# Altium schematic sheet SYSTEM_Control.SchDoc
size A4
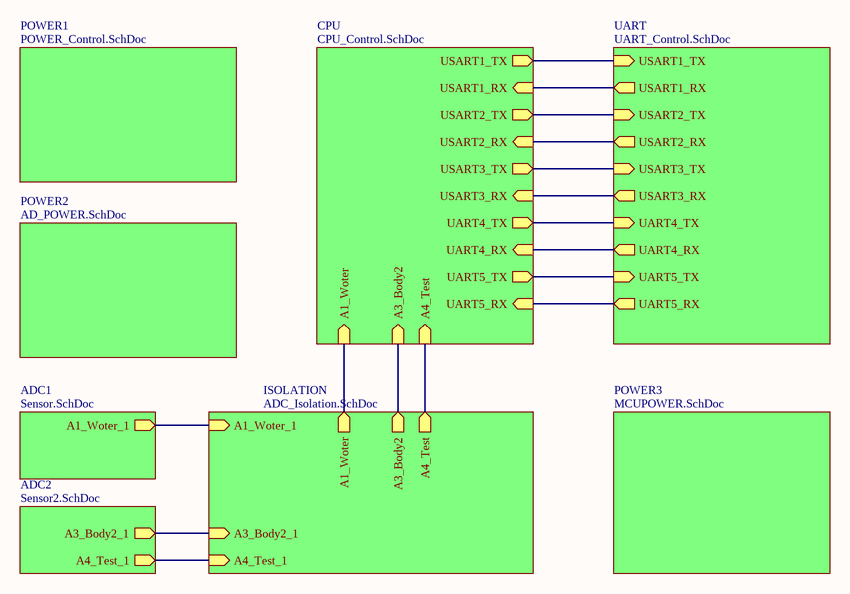
[diagram p0: SYSTEM_Control.SchDoc]

## Sub-sheets
ADC1 = Sensor.SchDoc: A1_Woter_1 (out)
ADC2 = Sensor2.SchDoc: A3_Body2_1 (out), A4_Test_1 (out)
CPU = CPU_Control.SchDoc: USART1_TX (out), USART1_RX (in), A1_Woter (in), A3_Body2 (in), A4_Test (in), UART4_TX (out), UART4_RX (in), UART5_TX (out), USART3_RX (in), USART3_TX (out), USART2_RX (in), USART2_TX (out), UART5_RX (in)
ISOLATION = ADC_Isolation.SchDoc: A1_Woter_1 (in), A3_Body2_1 (in), A4_Test_1 (in), A1_Woter (out), A3_Body2 (out), A4_Test (out)
POWER1 = POWER_Control.SchDoc: no entries
POWER2 = AD_POWER.SchDoc: no entries
POWER3 = MCUPOWER.SchDoc: no entries
UART = UART_Control.SchDoc: USART1_RX (out), USART1_TX (in), UART4_TX (in), UART4_RX (out), USART2_TX (in), USART2_RX (out), USART3_TX (in), UART5_TX (in), UART5_RX (out), USART3_RX (out)

## Nets
(unnamed): sheet CPU/USART1_TX, sheet UART/USART1_TX
(unnamed): sheet CPU/USART1_RX, sheet UART/USART1_RX
(unnamed): sheet CPU/A1_Woter, sheet ISOLATION/A1_Woter
(unnamed): sheet CPU/A3_Body2, sheet ISOLATION/A3_Body2
(unnamed): sheet CPU/A4_Test, sheet ISOLATION/A4_Test
(unnamed): sheet CPU/UART4_TX, sheet UART/UART4_TX
(unnamed): sheet CPU/UART4_RX, sheet UART/UART4_RX
(unnamed): sheet CPU/UART5_TX, sheet UART/UART5_TX
(unnamed): sheet CPU/USART3_RX, sheet UART/USART3_RX
(unnamed): sheet CPU/USART3_TX, sheet UART/USART3_TX
(unnamed): sheet CPU/USART2_RX, sheet UART/USART2_RX
(unnamed): sheet CPU/USART2_TX, sheet UART/USART2_TX
(unnamed): sheet CPU/UART5_RX, sheet UART/UART5_RX
(unnamed): sheet ADC1/A1_Woter_1, sheet ISOLATION/A1_Woter_1
(unnamed): sheet ADC2/A3_Body2_1, sheet ISOLATION/A3_Body2_1
(unnamed): sheet ADC2/A4_Test_1, sheet ISOLATION/A4_Test_1